# EAGLE design board2side small nopwrcble (EAGLE 7.3.0)
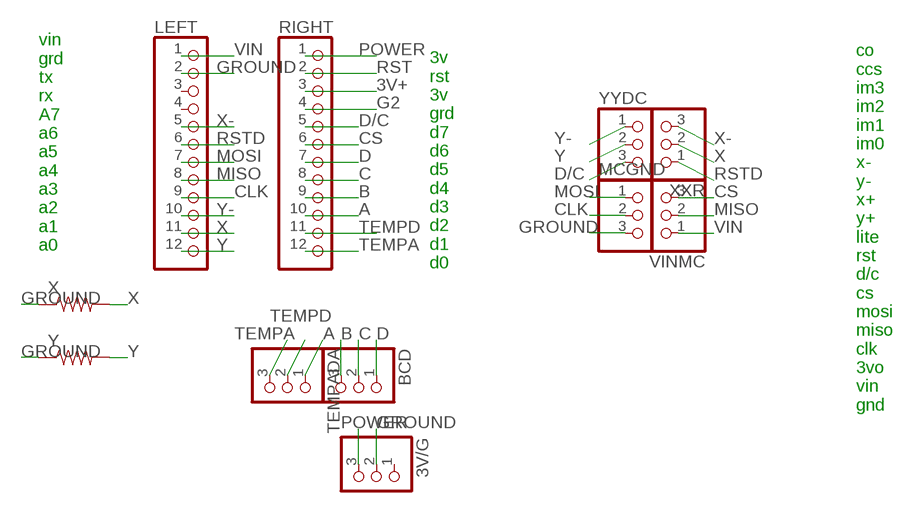
[diagram p0: schematic, sheet 1]

## Parts
3V/G  PINHD-1X3CB  [1X03-CLEANBIG]
BCD  PINHD-1X3CB  [1X03-CLEANBIG]
LEFT  PINHD-1X12-CB  [1X12-CB]
MCGND  PINHD-1X3CB  [1X03-CLEANBIG]
RIGHT  PINHD-1X12-CB  [1X12-CB]
TEMPADA  PINHD-1X3CB  [1X03-CLEANBIG]
VINMC  PINHD-1X3CB  [1X03-CLEANBIG]
X  10KOHM-1/6W-5%(PTH)KIT  [AXIAL-0.3-KIT]
XXR  PINHD-1X3CB  [1X03-CLEANBIG]
Y  10KOHM-1/6W-5%(PTH)KIT  [AXIAL-0.3-KIT]
YYDC  PINHD-1X3CB  [1X03-CLEANBIG]

## Nets
3V+: RIGHT.3
A: RIGHT.10 TEMPADA.1
B: BCD.3 RIGHT.9
C: BCD.2 RIGHT.8
CLK: LEFT.9 MCGND.2
CS: RIGHT.6 VINMC.3
D: BCD.1 RIGHT.7
D/C: RIGHT.5 YYDC.3
G2: RIGHT.4
GROUND: 3V/G.2 LEFT.2 MCGND.3 X.P$1 Y.P$1
MISO: LEFT.8 VINMC.2
MOSI: LEFT.7 MCGND.1
POWER: 3V/G.3 RIGHT.1
RST: RIGHT.2
RSTD: LEFT.6 XXR.1
TEMPA: RIGHT.12 TEMPADA.3
TEMPD: RIGHT.11 TEMPADA.2
VIN: LEFT.1 VINMC.1
X: LEFT.11 X.P$2 XXR.2
X-: LEFT.5 XXR.3
Y: LEFT.12 Y.P$2 YYDC.2
Y-: LEFT.10 YYDC.1
Unconnected: 3V/G.1 LEFT.3 LEFT.4

## Notes on the sheet
- vin
  grd
  tx
  rx
  A7
  a6
  a5
  a4
  a3
  a2
  a1
  a0
- 3v
  rst
  3v
  grd
  d7
  d6
  d5
  d4
  d3
  d2
  d1
  d0
- co
  ccs
  im3
  im2
  im1
  im0
  x-
  y-
  x+
  y+
  lite
  rst
  d/c
  cs
  mosi
  miso
  clk
  3vo
  vin
  gnd

## Library data of the parts
3V/G BCD MCGND TEMPADA VINMC XXR YYDC = adafruit:PINHD-1X3: PIN HEADER
LEFT RIGHT = adafruit:PINHD-1X12: PIN HEADER
X Y = SparkFun-Resistors:10KOHM-1/6W-5%(PTH): RES-08375; PROD_ID: RES-08375

## Board
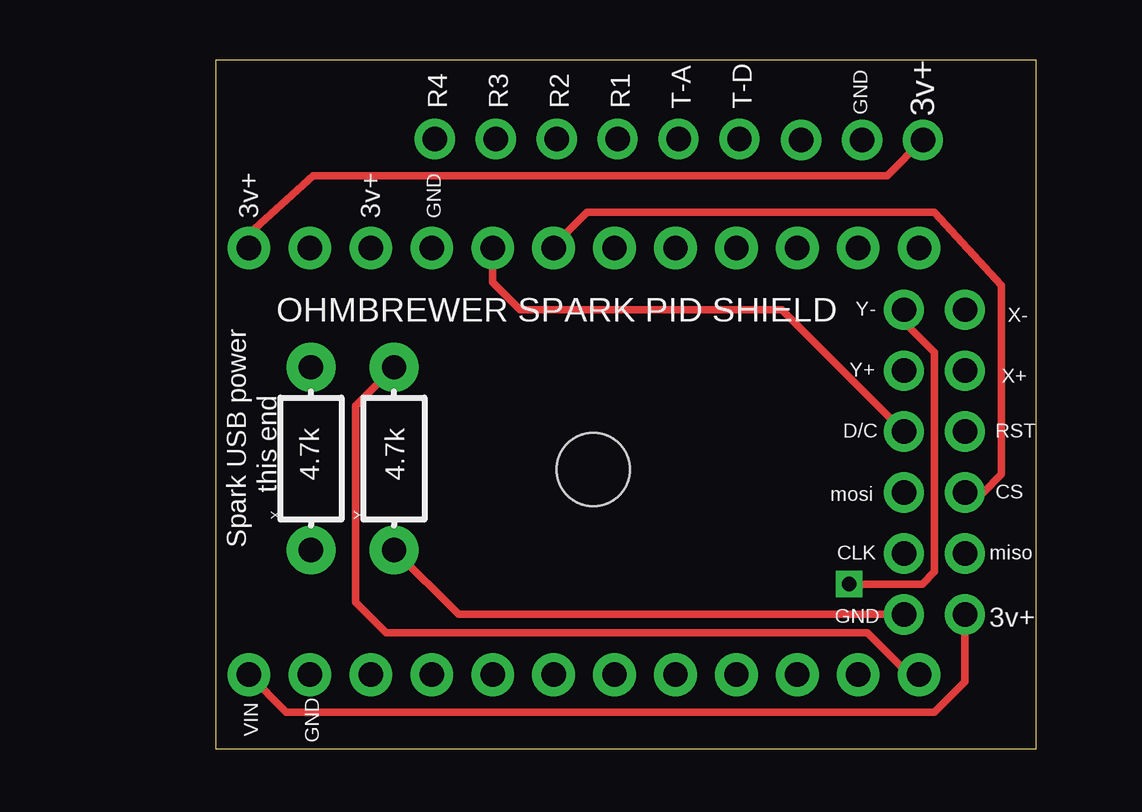
[diagram p1: board, top side]
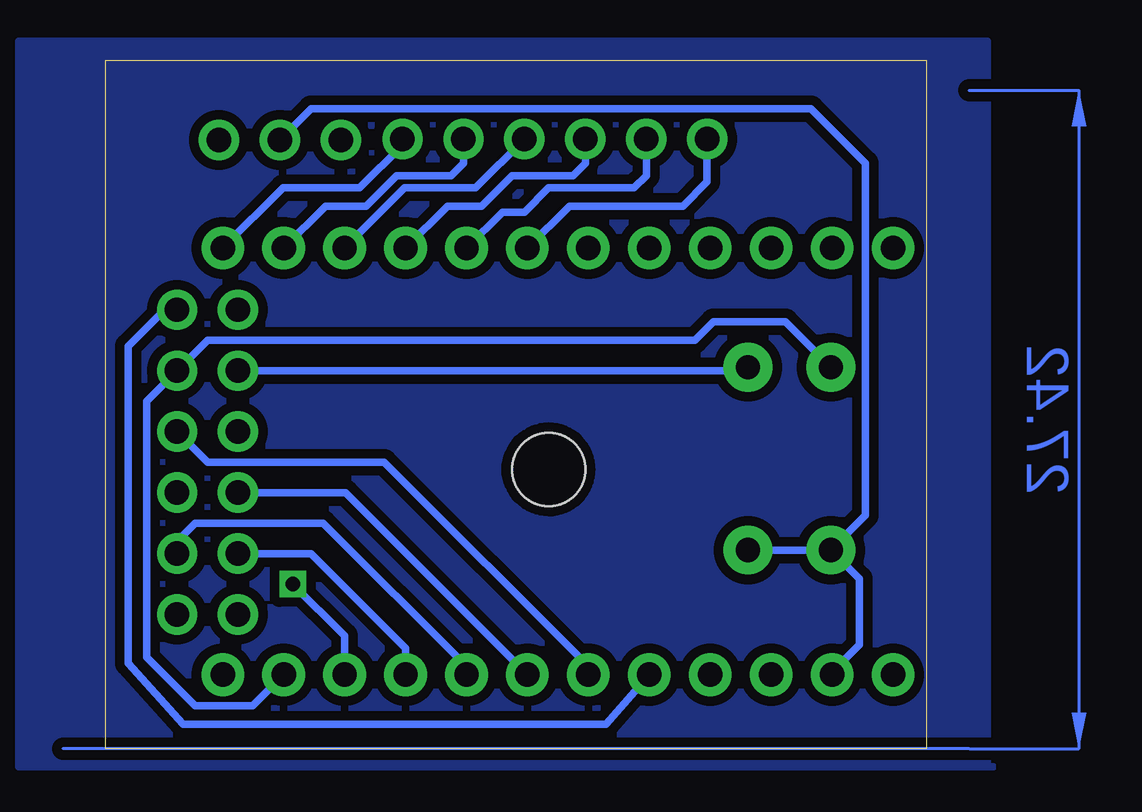
[diagram p2: board, bottom side, seen from below]

Size 34.21 x 28.69 mm. Coordinates in mm from the lower left corner, seen from the top.
Outline: 0,0 34.21,0 34.21,28.69 0,28.69 0,0
Copper layers (1*16): Top 0.035mm / dielectric 1.5mm / Bottom 0.035mm
Design rules "Othermill-DRC-1-64": minimum track width 8mil, minimum drill 0.8mm, track to track 0.39878125mm, track to pad 0.39878125mm, pad to pad 0.39878125mm, via to via 0.39878125mm, smd to smd 0mil, copper to edge 0mil, drill to drill 1mil, minimum pad ring 10mil, minimum via ring 10mil, stop-mask expansion 1mil, vias tented up to drill 30mil, thermal gap 10mil

### Footprints (pad centres in the part's own frame; a part is rotated, then mirrored left to right if it is on the bottom)
1X03-CLEANBIG = drill 1.016 pad 1.676: 1 -2.54,0; 2 0,0; 3 2.54,0
1X12-CB = drill 1.016 pad 1.778: 1 -13.97,0; 2 -11.43,0; 3 -8.89,0; 4 -6.35,0; 5 -3.81,0; 6 -1.27,0; 7 1.27,0; 8 3.81,0; 9 6.35,0; 10 8.89,0; 11 11.43,0; 12 13.97,0
STAND-OFF-TIGHT = hole 3.048: 0,0
AXIAL-0.3-KIT = drill 1.016 pad 2.032: P$1 -3.81,0; P$2 3.81,0

### Placement (x,y rotation side)
3V/G  26.95,25.36 0 top
BCD  11.68,25.4 0 top
LEFT  15.37,3.08 0 top
MCGND  28.7,8.13 270 top
RIGHT  15.37,20.86 0 top
TEMPADA  19.3,25.4 0 top
U$1  [STAND-OFF-TIGHT]  15.76,11.64 0 top
VINMC  31.24,8.13 90 top
X  3.99,12.08 90 top
XXR  31.24,15.75 90 top
Y  7.45,12.08 90 top
YYDC  28.7,15.75 270 top

### Tracks (layer width: path | path; a pad name or v marks a point on that pad's centre or on a via)
A
  Bottom 0.305: TEMPADA.1 18.8,23.37 21.75,23.37 RIGHT.10
B
  Bottom 0.305: BCD.3 14.22,24.38 14.73,23.88 17.27,23.88 18.54,22.61 19.97,22.61 RIGHT.9
C
  Bottom 0.305: BCD.2 11.68,23.88 12.19,23.37 15.75,23.37 16.76,22.35 17.68,22.35 RIGHT.8
CLK
  Bottom 0.305: LEFT.9 21.72,4.19 25.65,8.13 MCGND.2
CS
  Top 0.305: RIGHT.6 14.1,20.95 15.49,22.35 29.97,22.35 32.77,19.3 32.77,11.43 32,10.67 VINMC.3
D
  Bottom 0.305: BCD.1 9.14,23.62 10.16,22.61 14.89,22.61 RIGHT.7
D/C
  Top 0.305: RIGHT.5 11.56,19.43 12.7,18.29 23.62,18.29 YYDC.3
GROUND
  Top 0.305: MCGND.3 10.13,5.59 Y.P$1
  Bottom 0.305: X.P$1 Y.P$1 | LEFT.2 3.81,3.21 3.81,3.3 2.79,4.32 2.79,7.08 X.P$1 | 3V/G.2 25.65,26.67 4.83,26.67 2.54,24.38 2.54,9.72 X.P$1
MISO
  Bottom 0.305: LEFT.8 19.18,3.43 25.15,9.4 30.48,9.4 30.99,8.89 30.99,8.38 VINMC.2
MOSI
  Bottom 0.305: MCGND.1 24.22,10.67 LEFT.7
N$1
  pour Bottom: -2.54,29.46 37.85,29.46 37.85,-0.76 -2.79,-0.76 -2.54,-0.76
N$2  (via drill 0.6)
  other vias: 26.42,6.86
POWER
  Top 0.305: RIGHT.1 1.4,21.46 4.06,23.88 28.01,23.88 3V/G.3
RSTD
  Bottom 0.305: LEFT.6 14.1,3.43 22.61,11.94 29.97,11.94 XXR.1
TEMPA
  Bottom 0.305: TEMPADA.3 21.84,25.15 23.62,23.37 26.83,23.37 RIGHT.12
TEMPD
  Bottom 0.305: TEMPADA.2 19.3,24.38 19.81,23.88 22.1,23.88 23.37,22.61 25.05,22.61 RIGHT.11
VIN
  Top 0.305: VINMC.1 31.24,2.79 29.97,1.52 2.95,1.52 LEFT.1
X
  Bottom 0.305: X.P$2 5.87,17.78 8.89,17.78 9.65,17.02 29.97,17.02 XXR.2 32.51,14.48 32.51,3.81 30.48,1.78 28.1,1.78 LEFT.11
X-
  Bottom 0.305: XXR.3 31.75,18.29 33.27,16.76 33.27,3.56 30.99,1.02 13.37,1.02 LEFT.5
Y
  Top 0.305: LEFT.12 28.92,3.08 27.18,4.83 7.11,4.83 5.84,6.1 5.84,14.29 Y.P$2
  Bottom 0.305: YYDC.2 7.59,15.75 Y.P$2
Y-
  Top 0.305: YYDC.1 28.7,17.78 29.97,16.51 29.97,7.37 29.46,6.86 26.42,6.86 26.29,6.73
  Bottom 0.305: LEFT.10 24.26,4.7 26.42,6.86
(copper drawn outside any net)
  shapes: Bottom area x4

### Text on the board
tSilk: 3v+ | R4 | R3 | R2 | R1 | T-A | T-D | GND | 3v+ | 3v+ | GND | OHMBREWER SPARK PID SHIELD | Y- | X- | Y+ | X+ | D/C | RST | this end | 4.7k | 4.7k | mosi | CS | Spark USB power | CLK | miso | GND | 3v+ | VIN | GND